# EAGLE schematic Esp32Pins (EAGLE 9.6.2)
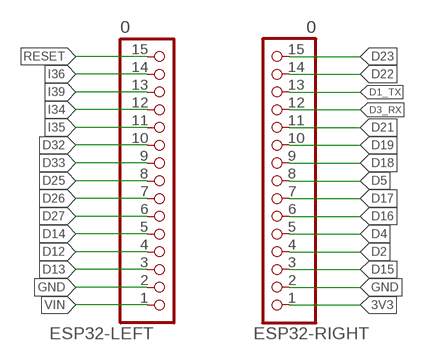
[diagram p0: schematic, sheet 1]

## Parts
ESP32-LEFT  0  PINHD-1X15  [1X15]
ESP32-RIGHT  0  PINHD-1X15  [1X15]

## Nets
3V3: ESP32-RIGHT.1
D1_TX: ESP32-RIGHT.13
D2: ESP32-RIGHT.4
D3_RX: ESP32-RIGHT.12
D4: ESP32-RIGHT.5
D5: ESP32-RIGHT.8
D12: ESP32-LEFT.4
D13: ESP32-LEFT.3
D14: ESP32-LEFT.5
D15: ESP32-RIGHT.3
D16: ESP32-RIGHT.6
D17: ESP32-RIGHT.7
D18: ESP32-RIGHT.9
D19: ESP32-RIGHT.10
D21: ESP32-RIGHT.11
D22: ESP32-RIGHT.14
D23: ESP32-RIGHT.15
D25: ESP32-LEFT.8
D26: ESP32-LEFT.7
D27: ESP32-LEFT.6
D32: ESP32-LEFT.10
D33: ESP32-LEFT.9
GND: ESP32-LEFT.2 ESP32-RIGHT.2
I34: ESP32-LEFT.12
I35: ESP32-LEFT.11
I36: ESP32-LEFT.14
I39: ESP32-LEFT.13
RESET: ESP32-LEFT.15
VIN: ESP32-LEFT.1

## Library data of the parts
ESP32-LEFT ESP32-RIGHT = pinhead:PINHD-1X15: PIN HEADER